# EAGLE design IR_Sync_Emitter (EAGLE 6.3)
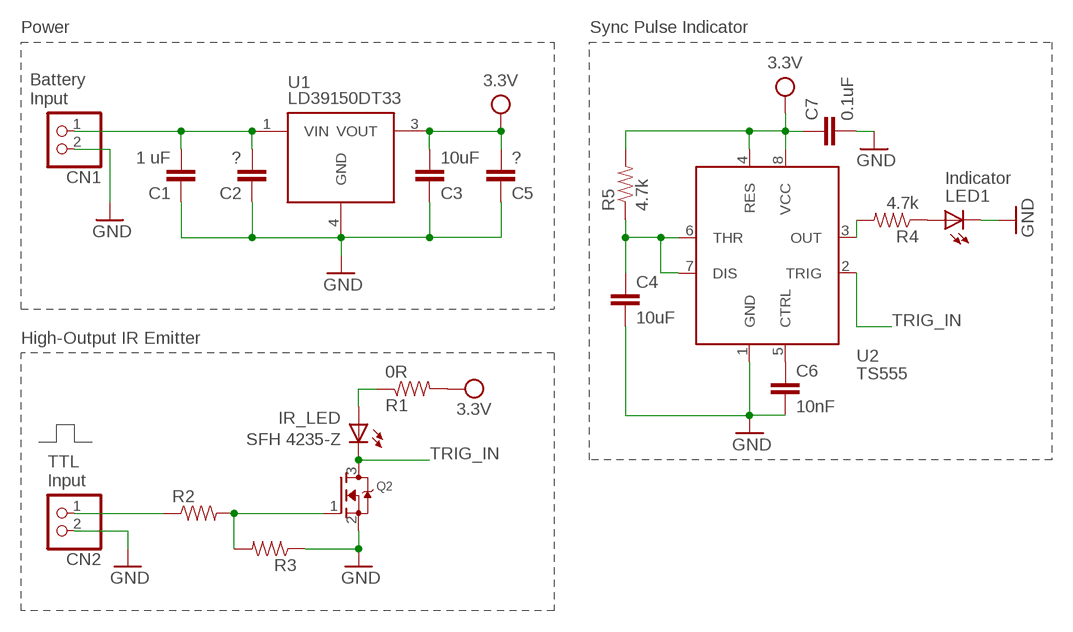
[diagram p0: schematic, sheet 1]

## Parts
C1  1 uF  CC0805-N  [CAPC2012X100N]
C2  ?  CC0805-N  [CAPC2012X100N]
C3  10uF  CC0805-N  [CAPC2012X100N]
C4  10uF  CC0805-N  [CAPC2012X100N]
C5  ?  CC0805-N  [CAPC2012X100N]
C6  10nF  CC0805-N  [CAPC2012X100N]
C7  0.1uF  CC0805-N  [CAPC2012X100N]
CN1  JST_2PIN-SMT-RA  [JST-PH-2-SMT-RA]
CN2  JST_2PIN-SMT-RA  [JST-PH-2-SMT-RA]
IR_LED  LEDIR_SMT16.2X11.2  [LED_SMT6.2X11.2]
LED1  LED0603  [CHIPLED_0603]
Q2  MOSFET-NREFLOW  [SOT23]
R1  0R  RR1206-N  [RESC3116X65N]
R2  RR0805-N  [RESC2012X60N]
R3  RR0805-N  [RESC2012X60N]
R4  4.7k  RR0805-N  [RESC2012X60N]
R5  4.7k  RR0805-N  [RESC2012X60N]
U1  LM2931_FIXED  [DPAK]
U2  TS555  [SO08]

## Nets
GND: C1.1 C2.1 C3.1 C4.2 C5.1 C6.2 C7.2 CN1.2 CN2.2 LED1.C Q2.2(S) R3.1 U1.4(GND) U2.1(GND)
N$2: LED1.A R4.1
N$3: Q2.1(G) R2.2 R3.2
N$4: C1.2 C2.2 CN1.1 U1.1(VIN)
N$5: IR_LED.A R1.1
N$7: CN2.1 R2.1
N$9: R4.2 U2.3(OUT)
N$10: C4.1 R5.1 U2.6(THR) U2.7(DIS)
N$11: C6.1 U2.5(CTRL)
TRIG_IN: IR_LED.C Q2.3(D) U2.2(TRIG)
VDD: C3.2 C5.2 C7.1 R1.2 R5.2 U1.3(VOUT) U2.4(RES) U2.8(VCC)

## Notes on the sheet
- Power | Sync Pulse Indicator
- 3.3V
- 3.3V
- Battery
  Input
- LD39150DT33
- Indicator
- High-Output IR Emitter
- 3.3V
- SFH 4235-Z
- TTL
  Input

## Library data of the parts
C1-C7 = Ramshur:C: Capacitor (english/metric) cermaic capacitor nominal landpattern (N).
CN1 CN2 = _adafruit:JST_2PIN: JST 2-Pin Connectors of various flavors SMT-RA (S2B-PH-SM4) 4UConnector #17311 SMT (B2B-PH-SM4) THM-RA (S2B-PH) THM (B2B-PH)
IR_LED LED1 = Ramshur:LED: LED
Q2 = _adafruit:MOSFET-N: N-Channel Mosfet 2N7002E - 60V 260mA SOT23 [Digikey: 2N7002ET1GOSTR-ND] - REEL BSH103 - 30V 850mA SOT23 [Digikey: 568-5013-1-ND]
R1-R5 = Ramshur:R: Resistor Basic schematic elements and footprints for 0603, 1206, and PTH resistors.
U1 = SparkFun-PowerIC:LM2931_FIXED: LDO regulator with reverse battery protection- very durable!
U2 = Ramshur:TS555

## Board
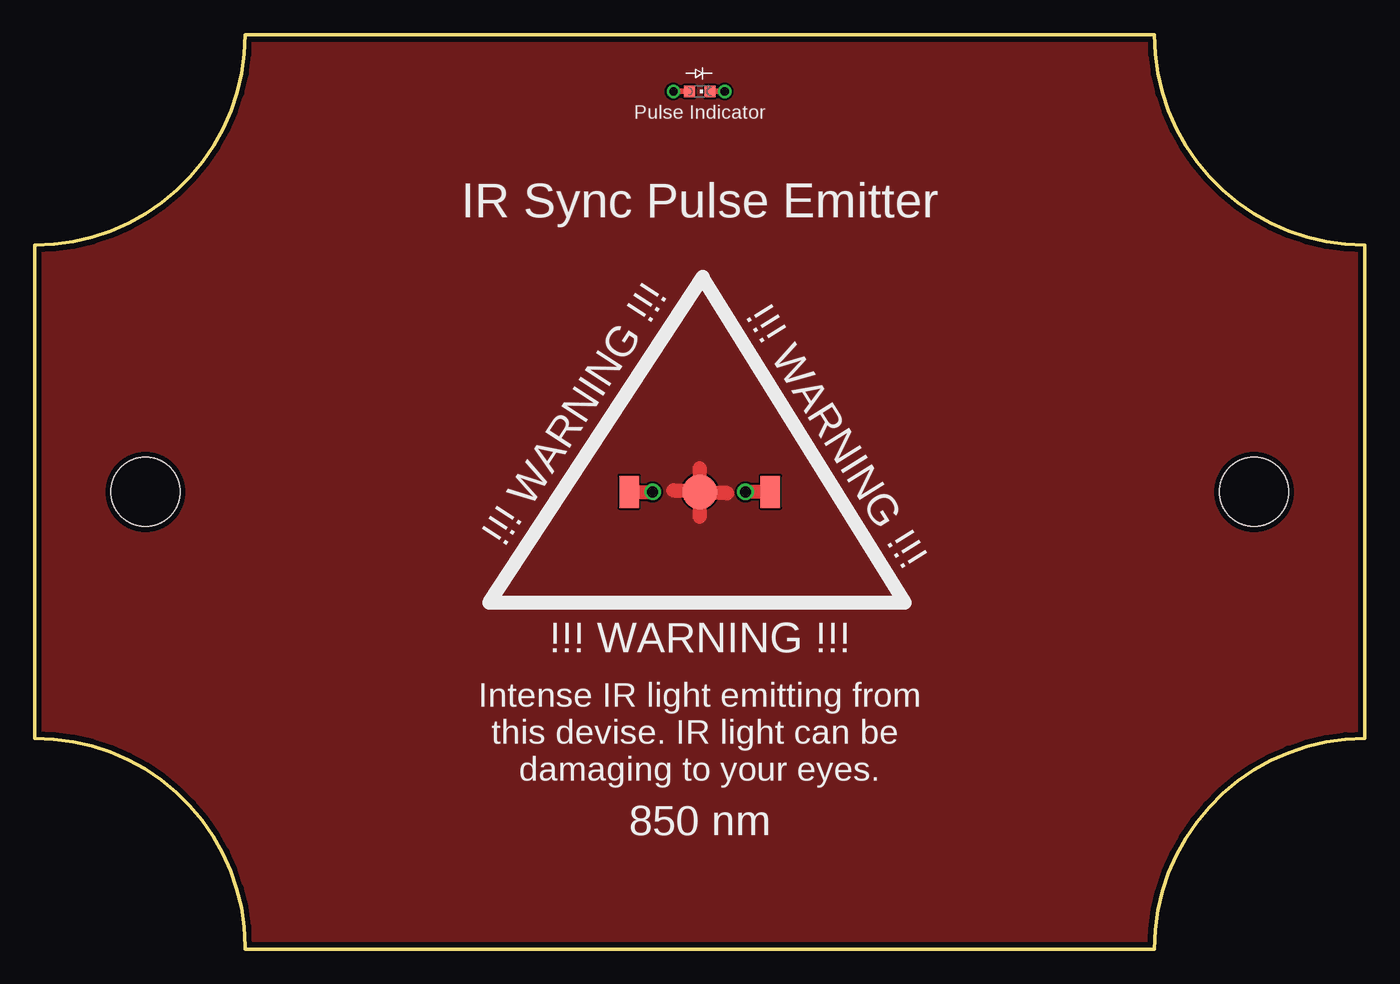
[diagram p1: board, top side]
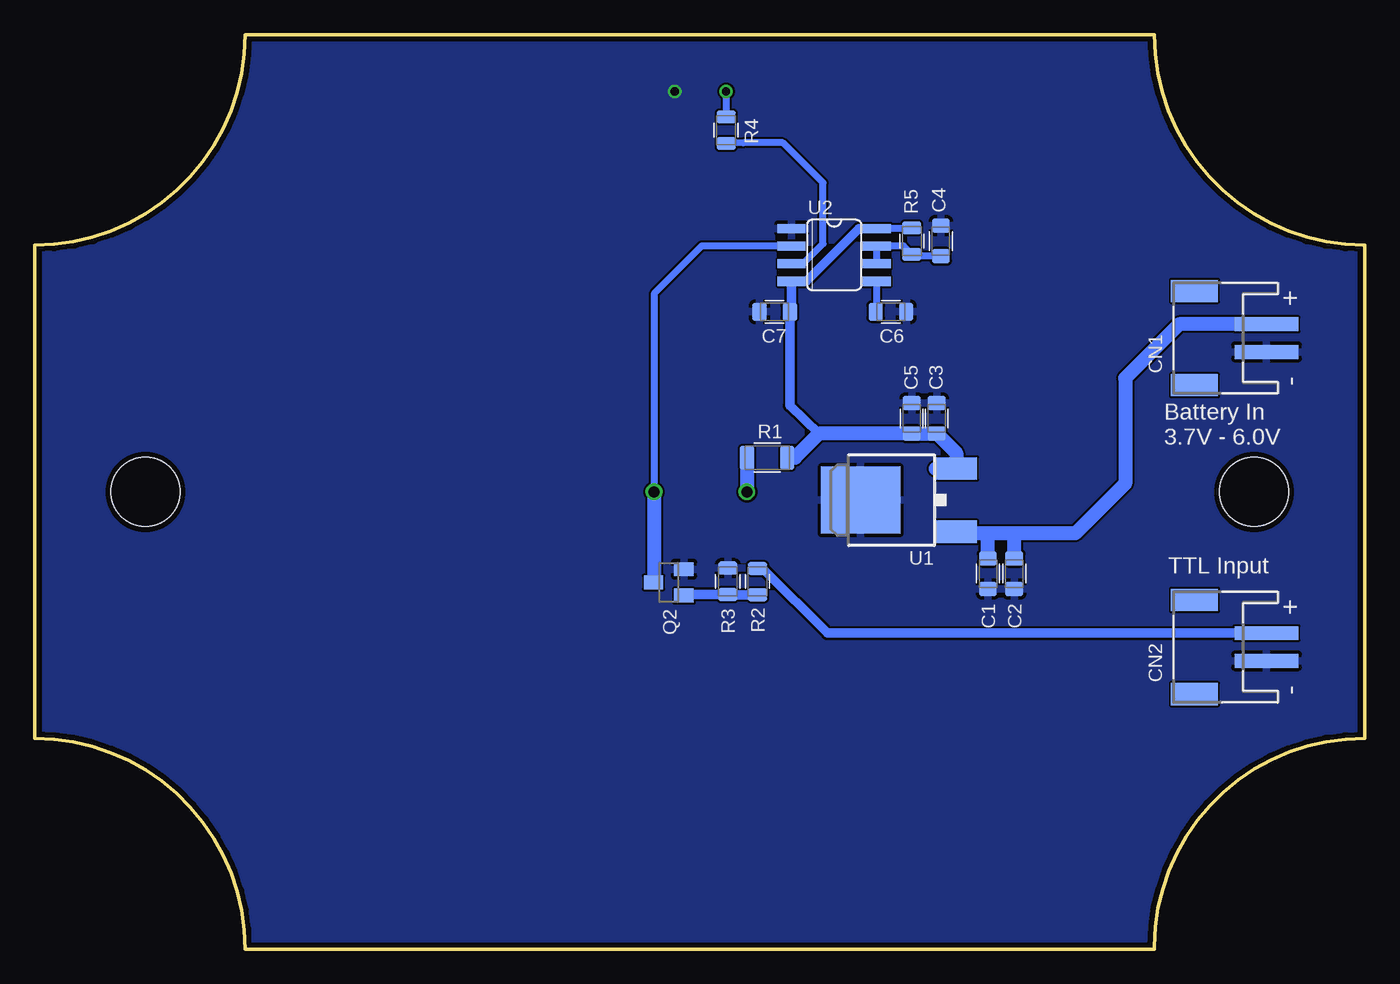
[diagram p2: board, bottom side, seen from below]

Size 96 x 66 mm. Coordinates in mm from the lower left corner, seen from the top.
Outline: 0,50.8 0,15.2 arc-90 15.2,0.2 15.2,0 80.8,0 arc-90 96,15.2 96,50.8 arc-90 80.8,66 15.2,66 arc-90 0,50.8
Outline: 0.1,50.8 0,50.8
Copper layers (1*16): Top 0.0356mm / dielectric 1.5011mm / Bottom 0.0356mm
Design rules "LaenPCBOrder *": minimum track width 6mil, minimum drill 13mil, track to track 6mil, track to pad 6mil, pad to pad 6mil, via to via 6mil, smd to smd 6mil, copper to edge 15mil, drill to drill 6mil, minimum pad ring 7mil, minimum via ring 7mil, stop-mask expansion 4mil, vias tented up to drill 1mm, thermal gap 10mil
Holes 5 mm at 8,33 88,33

### Footprints (pad centres in the part's own frame; a part is rotated, then mirrored left to right if it is on the bottom)
CAPC2012X100N = smd 1.05 x 1.3: 1 -1.1,0; 2 1.1,0
JST-PH-2-SMT-RA = smd 1 x 4.6: 1 1,-3.7; 2 -1,-3.7 | smd 1.6 x 3.4: NC1 -3.4,1.5; NC2 3.4,1.5
LED_SMT6.2X11.2 = smd 1.4 x 2.3: A -5.1,0; C 5.1,0 | smd 2.5 x 2.5: PAD 0,0
CHIPLED_0603 = smd 0.8 x 0.8: A 0,-0.75; C 0,0.75
SOT23 = smd 1 x 1.4: 1 -0.95,-1.1; 2 0.95,-1.1; 3 0,1.1
RESC3116X65N = smd 1.02 x 1.73: 1 -1.455,0; 2 1.455,0
RESC2012X60N = smd 0.92 x 1.38: 1 -0.955,0; 2 0.955,0
DPAK = smd 1.6 x 3: 1 -2.28,-5.31; 3 2.28,-5.31 | smd 4.826 x 5.715: 4 0,1.588
SO08 = smd 0.66 x 2.032: 1 -1.905,-3.073; 2 -0.635,-3.073; 3 0.635,-3.073; 4 1.905,-3.073; 5 1.905,3.073; 6 0.635,3.073; 7 -0.635,3.073; 8 -1.905,3.073

### Placement (x,y rotation side)
C1  27.2,27.1 90 bottom
C2  25.3,27.1 90 bottom
C3  30.9,38.3 270 bottom
C4  30.6,51.1 90 bottom
C5  32.7,38.3 270 bottom
C6  34.2,46 0 bottom
C7  42.6,46 180 bottom
CN1  10.8,44.1 90 bottom
CN2  10.8,21.8 90 bottom
IR_LED  48,33 0 top
LED1  48,61.9 270 top
Q2  50.24,26.46 90 bottom
R1  43.14,35.47 0 bottom
R2  43.83,26.52 270 bottom
R3  45.98,26.54 270 bottom
R4  46.1,59.1 270 bottom
R5  32.7,51.1 90 bottom
U1  34.8,32.4 90 bottom
U2  38.3,50.1 270 bottom

### Tracks (layer width: path | path; a pad name or v marks a point on that pad's centre or on a via)
GND  (via drill 0.6 pad 0.8)
  Top 0.406: v49.8,61.9 LED1.C
  pour Bottom: 15.2,66 80.8,66 arc90 96,50.8 96,15.2 95.9,15.2 arc90 80.8,0 15.2,0 arc90 0.1,15.2 0,15.2 0,50.8 arc90
N$1
  Top 1: 48,33 48,34.7 | 46.1,33.1 47.2,33.1 | 48,31.2 48,32.5 | 50,32.9 48,32.9
  pour Top: 15.2,66 80.8,66 arc90 96,50.8 96,15.2 95.9,15.2 arc90 80.8,0 15.2,0 arc90 0.1,15.2 0,15.2 0,50.8 arc90
N$2  (via drill 0.6 pad 0.8)
  Top 0.406: v46.1,61.9 LED1.A
  Bottom 0.5: v46.1,61.9 R4.1
N$3
  Bottom 0.7: R2.2 45.96,25.57 R3.2 49.06,25.59 Q2.1
N$4
  Bottom 1: CN1.1 13.4,45.1 17.3,41.2 17.3,33.6 20.9,30 25.4,30 | 25.4,30 27.2,30 | 27.2,30 29.37,30 U1.1 | C2.2 25.3,29.9 25.4,30 | C1.2 27.2,30
N$5  (via drill 0.8 pad 0.8)
  Top 1: IR_LED.A v44.6,33
  Bottom 1: R1.1 v44.6,33
N$7
  Bottom 0.7: R2.1 43.76,27.4 43.4,27.4 38.8,22.8 CN2.1
N$9
  Bottom 0.5: U2.3 40.53,49.47 39.1,50.9 39.1,55.3 42,58.2 44.84,58.2 R4.2
N$10
  Bottom 0.5: U2.6 U2.7 33.29,50.73 R5.1 32.55,50 C4.1
N$11
  Bottom 0.5: C6.1 35.23,46.07 U2.5
TRIG_IN  (via drill 0.8 pad 1)
  Top 1: IR_LED.C v51.3,33
  Bottom 0.5: U2.2 47.87,50.73 51.3,47.3 v51.3,33
  Bottom 0.7: 51.3,26.5 Q2.3
  Bottom 1: v51.3,33 51.3,26.5
VDD
  Bottom 0.5: R5.2 32.75,52 U2.8 36.5,52 | C7.1 41.37,46.47 | U2.4 40.3,48.2
  Bottom 0.7: 41.37,46.47 U2.4 | 40.3,48.2 36.5,52 | C7.1 41.5,39.22 39.38,37.2
  Bottom 1: 30.98,34.68 U1.3 29.49,35.79 C3.2 C5.2 39.38,37.2 41.12,35.47 R1.2

### Text on the board
tPlace: Pulse Indicator | IR Sync Pulse Emitter | !!! WARNING !!! | !!! WARNING !!! | !!! WARNING !!! | Intense IR light emitting from / this devise. IR light can be / damaging to your eyes. | 850 nm
bPlace: Battery In / 3.7V - 6.0V | TTL Input